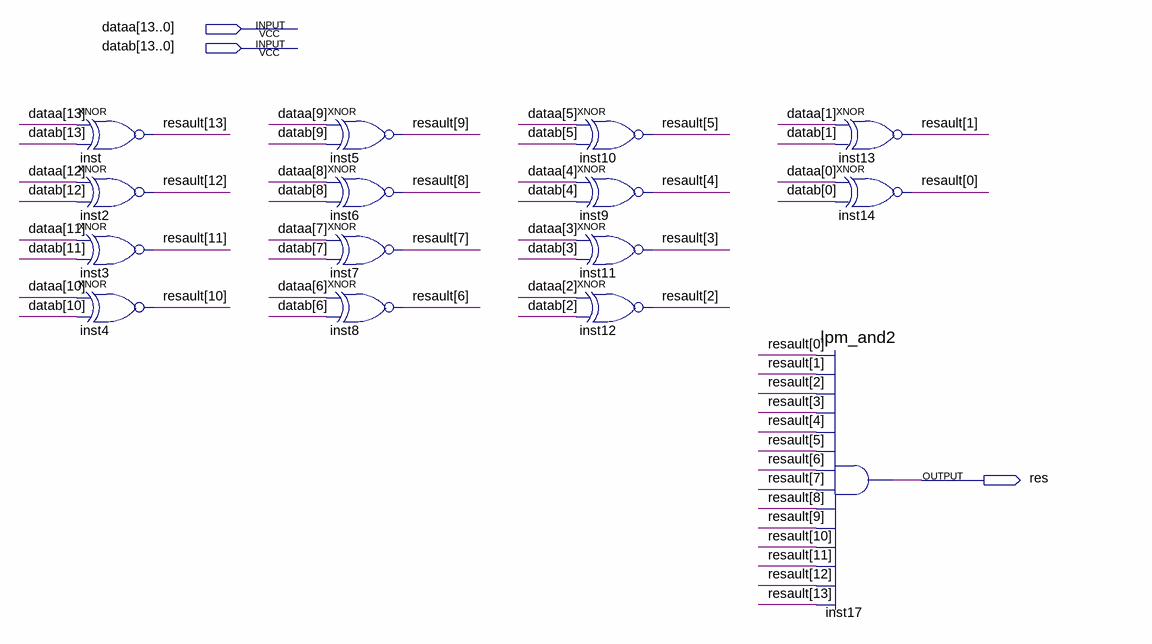
[diagram p0: schematic sheet]
// Quartus schematic CMP.bdf as structural Verilog: 15 symbols, 3 pins
module CMP (
  input  [13:0] dataa,
  input  [13:0] datab,
  output res
);

  wire [13:0] resault;

  xnor inst (resault[13], dataa[13], datab[13]);
  xnor inst2 (resault[12], dataa[12], datab[12]);
  xnor inst3 (resault[11], dataa[11], datab[11]);
  xnor inst4 (resault[10], dataa[10], datab[10]);
  xnor inst5 (resault[9], dataa[9], datab[9]);
  xnor inst6 (resault[8], dataa[8], datab[8]);
  xnor inst7 (resault[7], dataa[7], datab[7]);
  xnor inst8 (resault[6], dataa[6], datab[6]);
  xnor inst10 (resault[5], dataa[5], datab[5]);
  xnor inst9 (resault[4], dataa[4], datab[4]);
  xnor inst11 (resault[3], dataa[3], datab[3]);
  xnor inst12 (resault[2], dataa[2], datab[2]);
  xnor inst13 (resault[1], dataa[1], datab[1]);
  xnor inst14 (resault[0], dataa[0], datab[0]);
  lpm_and2 inst17 (
    .data0(resault[0]), .data1(resault[1]), .data2(resault[2]), .data3(resault[3]), .data4(resault[4]),
    .data5(resault[5]), .data6(resault[6]), .data7(resault[7]), .data8(resault[8]), .data9(resault[9]),
    .data10(resault[10]), .data11(resault[11]), .data12(resault[12]), .data13(resault[13]), .result(res));
endmodule
